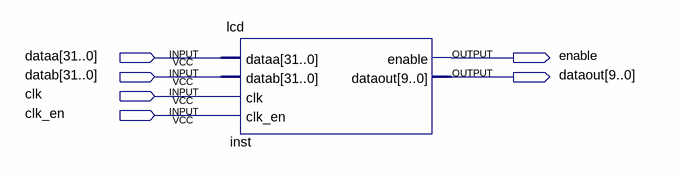
[diagram p0: schematic sheet]
// Quartus schematic LCD.bdf as structural Verilog: 1 symbols, 6 pins
module LCD (
  input  [31:0] dataa,
  input  [31:0] datab,
  input  clk,
  input  clk_en,
  output enable,
  output [9:0] dataout
);

  lcd inst (.dataa(dataa), .datab(datab), .clk(clk), .clk_en(clk_en), .enable(enable), .dataout(dataout));
endmodule
